# EasyEDA schematic Elektrisch schema EasyEDA.json
TITLE: Kleine zeilboot; REV: 1.0; Date: 2024-01-24; Sheet: 1/1; Company: RAAST
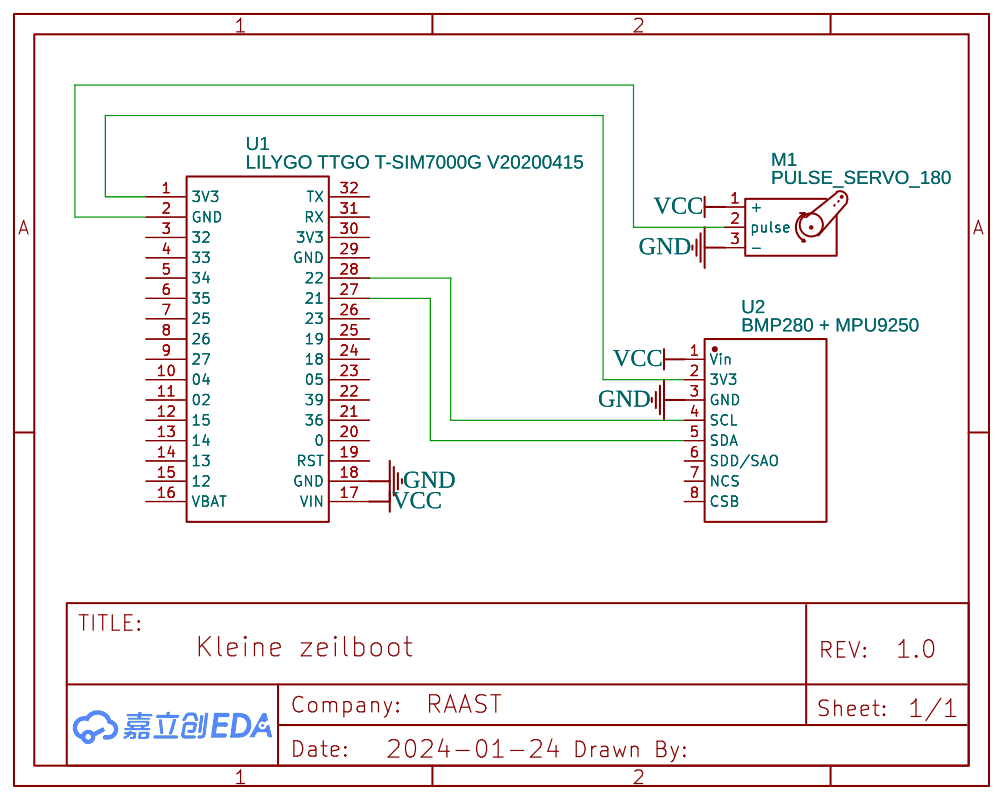
[diagram p0: schematic sheet]

## Parts
M1  PULSE_SERVO_180  [SERVO]
U1  LILYGO TTGO T-SIM7000G V20200415  [LILYGO TTGO T-SIM7000G]
U2  BMP280 + MPU9250  [BMP280 + MPU9250]

## Library data of the parts
M1 = PULSE_SERVO_180: Contributor: Лев Круглов; license: https://www.gnu.org/licenses/lgpl-2.1.html; Supplier: Sincere Company Store
U1 = LILYGO TTGO T-SIM7000G V20200415: Manufacturer: LILYGO; Manufacturer Part: T-SIM7000G; Supplier: Add New Supplier; link: https://www.aliexpress.com/item/4000542688096.html; Contributor: darshanbabu44
U2 = BMP280 + MPU9250: Contributor: pedromancano

## Nets
GND: M1.3(-) U1.18(GND) U2.3(GND)
VCC: M1.1(+) U1.17(VIN) U2.1(Vin)
Net-(M1-2): M1.2(pulse) U1.2(GND)
Net-(U1-1): U1.1(3V3) U2.2(3V3)
Net-(U1-27): U1.27(21) U2.5(SDA)
Net-(U1-28): U1.28(22) U2.4(SCL)

Not connected (* = marked no-connect by the designer): U1 3(32) 4(33) 5(34) 6(35) 7(25) 8(26) 9(27) 10(04) 11(02) 12(15) 13(14) 14(13) 15(12) 16(VBAT) 19(RST) 20(0) 21(36) 22(39) 23(05) 24(18) 25(19) 26(23) 29(GND) 30(3V3) 31(RX) 32(TX); U2 6(SDD/SAO) 7(NCS) 8(CSB)

## Notes on the sheet
- Thomas van Egmond
